# Altium schematic sheet Connections.SchDoc
size A4
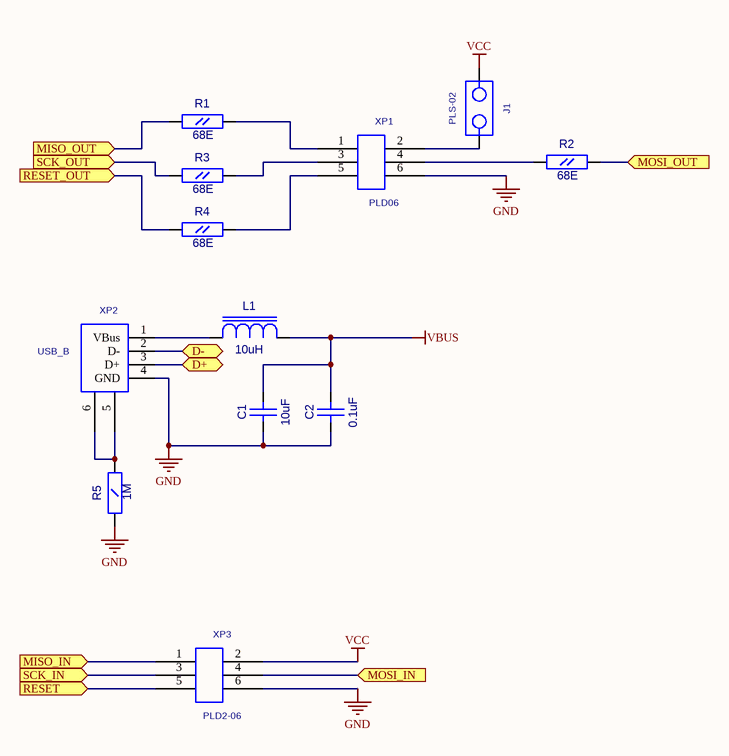
[diagram p0: Connections.SchDoc]

## Parts
C1  10uF  [CC0805]
C2  0.1uF  [CC0603]
J1  PLS-02  [PLS-02]
L1  value 10uH  [RC0805]  (hidden comment: L0805)
R1  68E  [RC0603]
R2  68E  [RC0603]
R3  68E  [RC0603]
R4  68E  [RC0603]
R5  1M  [RC1206]
XP1  PLD06  [PIN6]
XP2  USB_B  [USB-B]
XP3  PLD2-06  [PLD2-06]

## Ports
D+, D-, MISO_IN (in), MISO_OUT (in), MOSI_IN (in), MOSI_OUT (in), RESET (in), RESET_OUT (in), SCK_IN (in), SCK_OUT (in)

## Nets
GND: C1.1(A) C2.1(A) R5.1(A) XP1.6 XP2.4(GND) XP3.6
VBUS: C1.2(B) C2.2(B) L1.2(B)
VCC: J1.1 XP3.2
D+: XP2.3(D+) ; port D+
D-: XP2.2(D-) ; port D-
MISO_IN: XP3.1 ; port MISO_IN
MISO_OUT: R1.1(A) ; port MISO_OUT
MOSI_IN: XP3.4 ; port MOSI_IN
MOSI_OUT: R2.2(B) ; port MOSI_OUT
RESET: XP3.5 ; port RESET
RESET_OUT: R4.1(A) ; port RESET_OUT
SCK_IN: XP3.3 ; port SCK_IN
SCK_OUT: R3.1(A) ; port SCK_OUT
NetJ1_2: J1.2 XP1.2
NetL1_1: L1.1(A) XP2.1(VBus)
NetR1_2: R1.2(B) XP1.1
NetR2_1: R2.1(A) XP1.4
NetR3_2: R3.2(B) XP1.3
NetR4_2: R4.2(B) XP1.5
NetR5_2: R5.2(B) XP2.5 XP2.6

## Library data of the parts
C1 = CC0805: Value: 10uF
C2 = CC0603: Value: 0.1uF
R1-R4 = RC0603: Value: 68E
R5 = RC1206: Value: 1M
J1 = PLS-02: Value: *
XP1 = PLD06: Value: *
XP2 = USB_B: Value: *
XP3 = PLD2-06: Value: *